# EAGLE design EQBasePCB_V_1_0 (EAGLE 9.5.2)
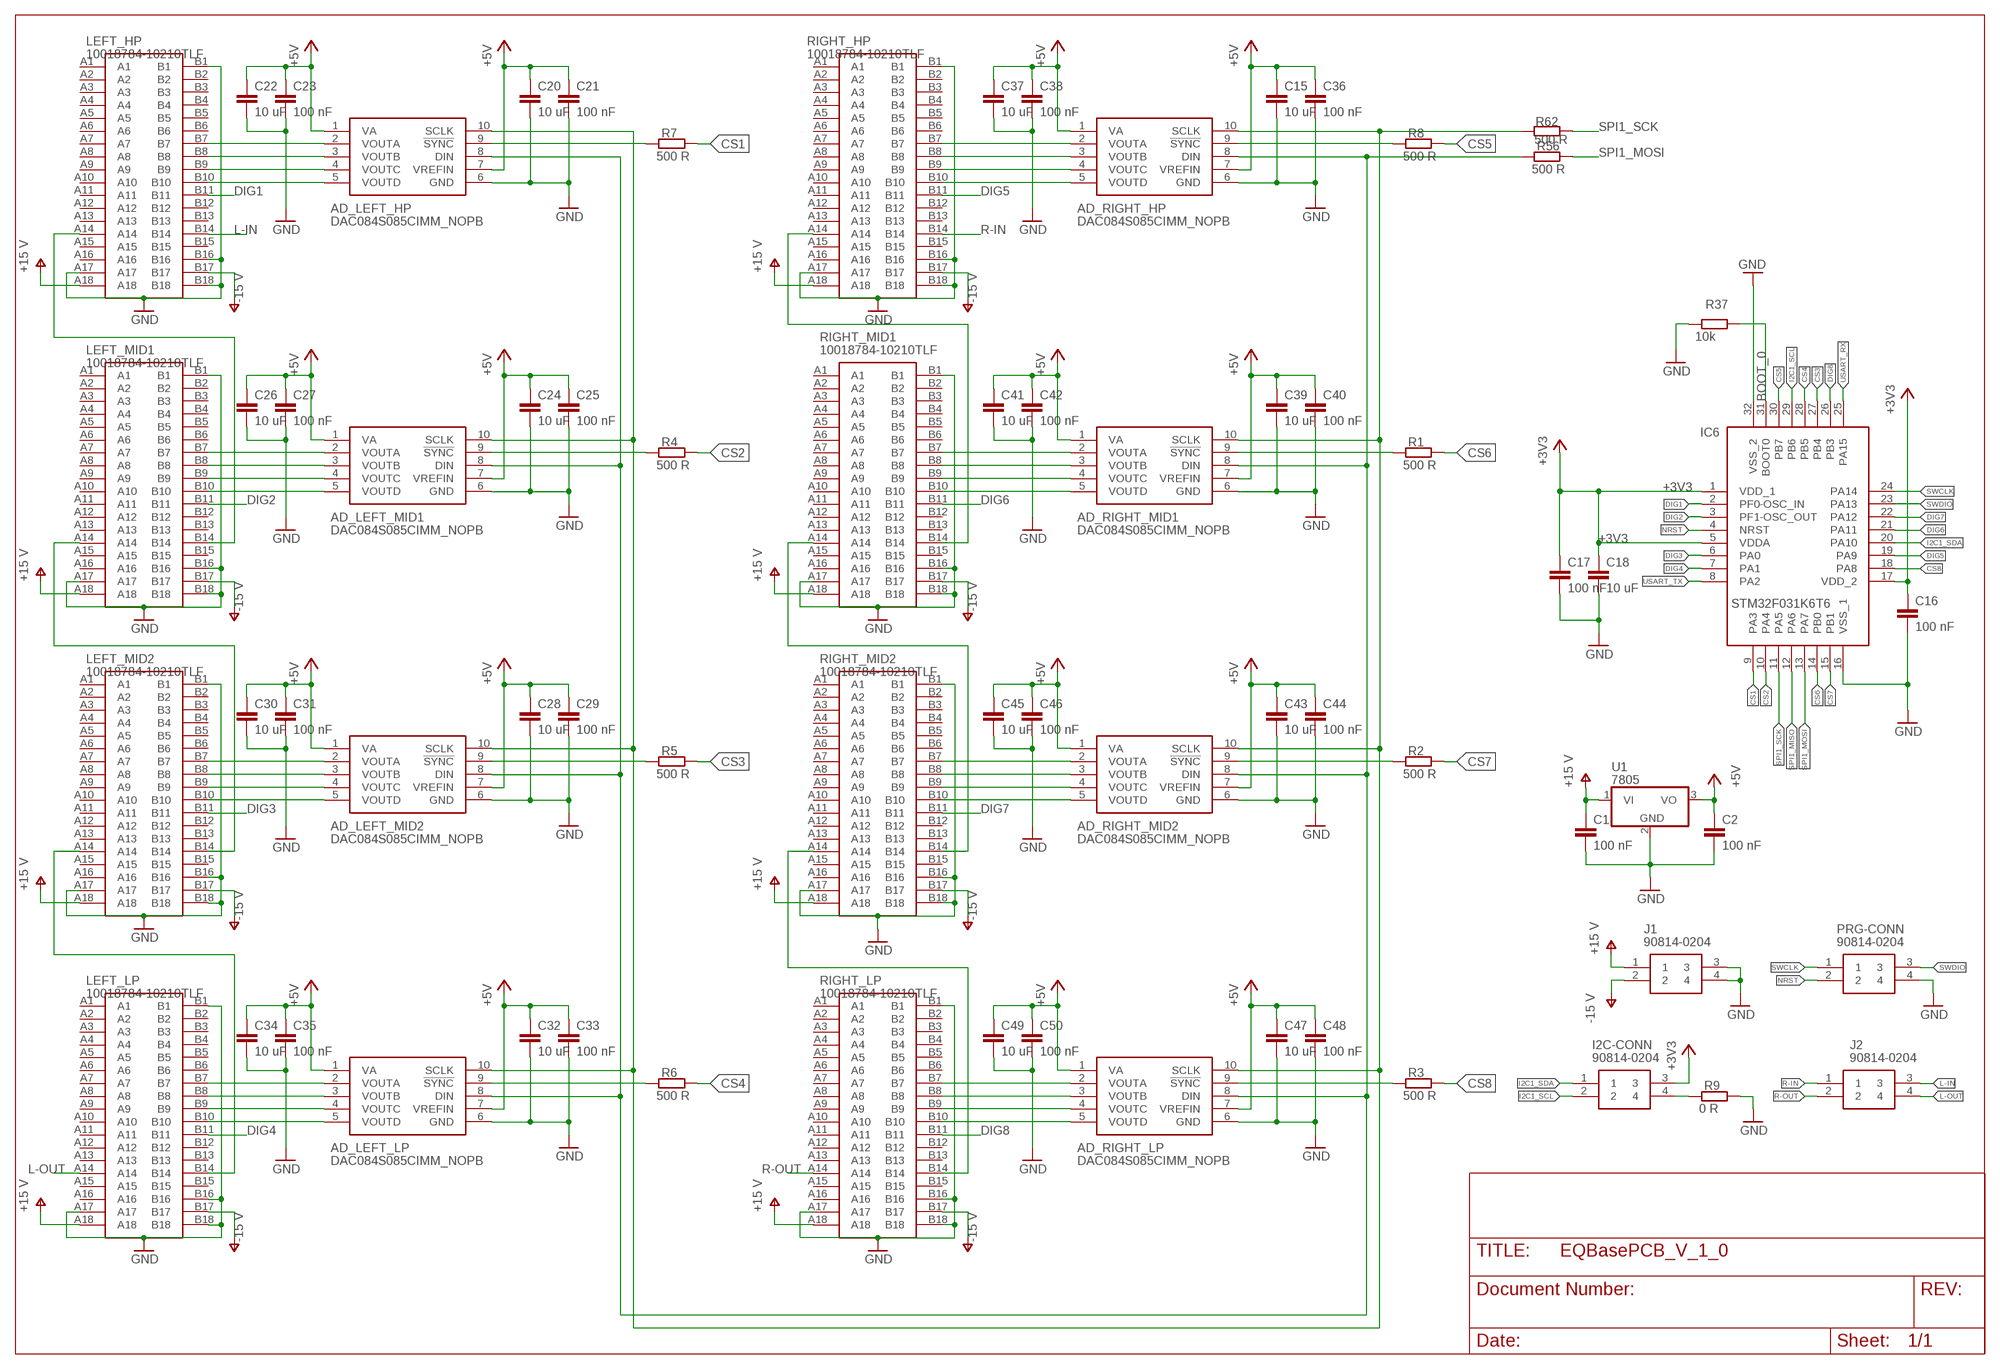
[diagram p0: schematic, sheet 1]

## Parts
AD_LEFT_HP  DAC084S085CIMM_NOPB  [SOP50P490X110-10N]
AD_LEFT_LP  DAC084S085CIMM_NOPB  [SOP50P490X110-10N]
AD_LEFT_MID1  DAC084S085CIMM_NOPB  [SOP50P490X110-10N]
AD_LEFT_MID2  DAC084S085CIMM_NOPB  [SOP50P490X110-10N]
AD_RIGHT_HP  DAC084S085CIMM_NOPB  [SOP50P490X110-10N]
AD_RIGHT_LP  DAC084S085CIMM_NOPB  [SOP50P490X110-10N]
AD_RIGHT_MID1  DAC084S085CIMM_NOPB  [SOP50P490X110-10N]
AD_RIGHT_MID2  DAC084S085CIMM_NOPB  [SOP50P490X110-10N]
C1  100 nF  CAPACITOR_0603  [C0603]
C2  100 nF  CAPACITOR_0603  [C0603]
C15  10 uF  CAPACITOR_1206  [C1206]
C16  100 nF  CAPACITOR_0603  [C0603]
C17  100 nF  CAPACITOR_0603  [C0603]
C18  10 uF  CAPACITOR_1206  [C1206]
C20  10 uF  CAPACITOR_1206  [C1206]
C21  100 nF  CAPACITOR_0603  [C0603]
C22  10 uF  CAPACITOR_1206  [C1206]
C23  100 nF  CAPACITOR_0603  [C0603]
C24  10 uF  CAPACITOR_1206  [C1206]
C25  100 nF  CAPACITOR_0603  [C0603]
C26  10 uF  CAPACITOR_1206  [C1206]
C27  100 nF  CAPACITOR_0603  [C0603]
C28  10 uF  CAPACITOR_1206  [C1206]
C29  100 nF  CAPACITOR_0603  [C0603]
C30  10 uF  CAPACITOR_1206  [C1206]
C31  100 nF  CAPACITOR_0603  [C0603]
C32  10 uF  CAPACITOR_1206  [C1206]
C33  100 nF  CAPACITOR_0603  [C0603]
C34  10 uF  CAPACITOR_1206  [C1206]
C35  100 nF  CAPACITOR_0603  [C0603]
C36  100 nF  CAPACITOR_0603  [C0603]
C37  10 uF  CAPACITOR_1206  [C1206]
C38  100 nF  CAPACITOR_0603  [C0603]
C39  10 uF  CAPACITOR_1206  [C1206]
C40  100 nF  CAPACITOR_0603  [C0603]
C41  10 uF  CAPACITOR_1206  [C1206]
C42  100 nF  CAPACITOR_0603  [C0603]
C43  10 uF  CAPACITOR_1206  [C1206]
C44  100 nF  CAPACITOR_0603  [C0603]
C45  10 uF  CAPACITOR_1206  [C1206]
C46  100 nF  CAPACITOR_0603  [C0603]
C47  10 uF  CAPACITOR_1206  [C1206]
C48  100 nF  CAPACITOR_0603  [C0603]
C49  10 uF  CAPACITOR_1206  [C1206]
C50  100 nF  CAPACITOR_0603  [C0603]
I2C-CONN  90814-0204  [MOLEX_90814-0204]
IC6  STM32F031K6T6  [QFP80P900X900X160-32N]
J1  90814-0204  [MOLEX_90814-0204]
J2  90814-0204  [MOLEX_90814-0204]
LEFT_HP  10018784-10210TLF  [1001878410210TLF]
LEFT_LP  10018784-10210TLF  [1001878410210TLF]
LEFT_MID1  10018784-10210TLF  [1001878410210TLF]
LEFT_MID2  10018784-10210TLF  [1001878410210TLF]
PRG-CONN  90814-0204  [MOLEX_90814-0204]
R1  500 R  RESISTOR_0603  [R0603]
R2  500 R  RESISTOR_0603  [R0603]
R3  500 R  RESISTOR_0603  [R0603]
R4  500 R  RESISTOR_0603  [R0603]
R5  500 R  RESISTOR_0603  [R0603]
R6  500 R  RESISTOR_0603  [R0603]
R7  500 R  RESISTOR_0603  [R0603]
R8  500 R  RESISTOR_0603  [R0603]
R9  0 R  RESISTOR_0603  [R0603]
R37  10k  RESISTOR_0603  [R0603]
R56  500 R  RESISTOR_0603  [R0603]
R62  500 R  RESISTOR_0603  [R0603]
RIGHT_HP  10018784-10210TLF  [1001878410210TLF]
RIGHT_LP  10018784-10210TLF  [1001878410210TLF]
RIGHT_MID1  10018784-10210TLF  [1001878410210TLF]
RIGHT_MID2  10018784-10210TLF  [1001878410210TLF]
U1  7805  78_SMD  [TO252]

## Nets
+3V3: C16.1 C17.1 C18.1 I2C-CONN.3 IC6.1(VDD_1) IC6.5(VDDA) IC6.17(VDD_2)
+5V: AD_LEFT_HP.1(VA) AD_LEFT_HP.7(VREFIN) AD_LEFT_LP.1(VA) AD_LEFT_LP.7(VREFIN) AD_LEFT_MID1.1(VA) AD_LEFT_MID1.7(VREFIN) AD_LEFT_MID2.1(VA) AD_LEFT_MID2.7(VREFIN) AD_RIGHT_HP.1(VA) AD_RIGHT_HP.7(VREFIN) AD_RIGHT_LP.1(VA) AD_RIGHT_LP.7(VREFIN) AD_RIGHT_MID1.1(VA) AD_RIGHT_MID1.7(VREFIN) AD_RIGHT_MID2.1(VA) AD_RIGHT_MID2.7(VREFIN) C2.1 C15.1 C20.1 C21.1 C22.1 C23.1 C24.1 C25.1 C26.1 C27.1 C28.1 C29.1 C30.1 C31.1 C32.1 C33.1 C34.1 C35.1 C36.1 C37.1 C38.1 C39.1 C40.1 C41.1 C42.1 C43.1 C44.1 C45.1 C46.1 C47.1 C48.1 C49.1 C50.1 U1.3(VO)
BOOT_0: IC6.31(BOOT0) R37.2
CS1: IC6.9(PA3) R7.2
CS2: IC6.10(PA4) R4.2
CS3: IC6.27(PB4) R5.2
CS4: IC6.28(PB5) R6.2
CS5: IC6.30(PB7) R8.2
CS6: IC6.14(PB0) R1.2
CS7: IC6.15(PB1) R2.2
CS8: IC6.18(PA8) R3.2
DIG1: IC6.2(PF0-OSC_IN) LEFT_HP.B11
DIG2: IC6.3(PF1-OSC_OUT) LEFT_MID1.B11
DIG3: IC6.6(PA0) LEFT_MID2.B11
DIG4: IC6.7(PA1) LEFT_LP.B11
DIG5: IC6.19(PA9) RIGHT_HP.B11
DIG6: IC6.21(PA11) RIGHT_MID1.B11
DIG7: IC6.22(PA12) RIGHT_MID2.B11
DIG8: IC6.26(PB3) RIGHT_LP.B11
GND: AD_LEFT_HP.6(GND) AD_LEFT_LP.6(GND) AD_LEFT_MID1.6(GND) AD_LEFT_MID2.6(GND) AD_RIGHT_HP.6(GND) AD_RIGHT_LP.6(GND) AD_RIGHT_MID1.6(GND) AD_RIGHT_MID2.6(GND) C1.2 C2.2 C15.2 C16.2 C17.2 C18.2 C20.2 C21.2 C22.2 C23.2 C24.2 C25.2 C26.2 C27.2 C28.2 C29.2 C30.2 C31.2 C32.2 C33.2 C34.2 C35.2 C36.2 C37.2 C38.2 C39.2 C40.2 C41.2 C42.2 C43.2 C44.2 C45.2 C46.2 C47.2 C48.2 C49.2 C50.2 IC6.16(VSS_1) IC6.32(VSS_2) J1.3 J1.4 LEFT_HP.A17 LEFT_HP.B1 LEFT_HP.B16 LEFT_HP.B18 LEFT_LP.A17 LEFT_LP.B1 LEFT_LP.B16 LEFT_LP.B18 LEFT_MID1.A17 LEFT_MID1.B1 LEFT_MID1.B16 LEFT_MID1.B18 LEFT_MID2.A17 LEFT_MID2.B1 LEFT_MID2.B16 LEFT_MID2.B18 PRG-CONN.4 R9.2 R37.1 RIGHT_HP.A17 RIGHT_HP.B1 RIGHT_HP.B16 RIGHT_HP.B18 RIGHT_LP.A17 RIGHT_LP.B1 RIGHT_LP.B16 RIGHT_LP.B18 RIGHT_MID1.A17 RIGHT_MID1.B1 RIGHT_MID1.B16 RIGHT_MID1.B18 RIGHT_MID2.A17 RIGHT_MID2.B1 RIGHT_MID2.B16 RIGHT_MID2.B18 U1.2(GND)
I2C1_SCL: I2C-CONN.2 IC6.29(PB6)
I2C1_SDA: I2C-CONN.1 IC6.20(PA10)
L-IN: J2.3 LEFT_HP.B14
L-OUT: J2.4 LEFT_LP.A14
N$1: AD_RIGHT_MID1.9(!SYNC) R1.1
N$2: AD_LEFT_MID1.5(VOUTD) LEFT_MID1.B10
N$3: I2C-CONN.4 R9.1
N$4: LEFT_HP.A14 LEFT_MID1.B14
N$5: LEFT_MID1.A14 LEFT_MID2.B14
N$6: LEFT_LP.B14 LEFT_MID2.A14
N$7: RIGHT_HP.A14 RIGHT_MID1.B14
N$8: RIGHT_MID1.A14 RIGHT_MID2.B14
N$9: RIGHT_LP.B14 RIGHT_MID2.A14
N$31: AD_LEFT_HP.8(DIN) AD_LEFT_LP.8(DIN) AD_LEFT_MID1.8(DIN) AD_LEFT_MID2.8(DIN) AD_RIGHT_HP.8(DIN) AD_RIGHT_LP.8(DIN) AD_RIGHT_MID1.8(DIN) AD_RIGHT_MID2.8(DIN) R56.1
N$32: AD_LEFT_HP.9(!SYNC) R7.1
N$33: AD_LEFT_HP.10(SCLK) AD_LEFT_LP.10(SCLK) AD_LEFT_MID1.10(SCLK) AD_LEFT_MID2.10(SCLK) AD_RIGHT_HP.10(SCLK) AD_RIGHT_LP.10(SCLK) AD_RIGHT_MID1.10(SCLK) AD_RIGHT_MID2.10(SCLK) R62.1
N$34: AD_LEFT_HP.2(VOUTA) LEFT_HP.B7
N$35: AD_LEFT_HP.3(VOUTB) LEFT_HP.B8
N$36: AD_LEFT_HP.4(VOUTC) LEFT_HP.B9
N$37: AD_LEFT_HP.5(VOUTD) LEFT_HP.B10
N$39: AD_LEFT_MID1.9(!SYNC) R4.1
N$41: AD_LEFT_MID1.2(VOUTA) LEFT_MID1.B7
N$42: AD_LEFT_MID1.3(VOUTB) LEFT_MID1.B8
N$43: AD_LEFT_MID1.4(VOUTC) LEFT_MID1.B9
N$46: AD_LEFT_MID2.9(!SYNC) R5.1
N$48: AD_LEFT_MID2.2(VOUTA) LEFT_MID2.B7
N$49: AD_LEFT_MID2.3(VOUTB) LEFT_MID2.B8
N$50: AD_LEFT_MID2.4(VOUTC) LEFT_MID2.B9
N$51: AD_LEFT_MID2.5(VOUTD) LEFT_MID2.B10
N$53: AD_LEFT_LP.9(!SYNC) R6.1
N$55: AD_LEFT_LP.2(VOUTA) LEFT_LP.B7
N$59: AD_LEFT_LP.3(VOUTB) LEFT_LP.B8
N$60: AD_LEFT_LP.4(VOUTC) LEFT_LP.B9
N$61: AD_LEFT_LP.5(VOUTD) LEFT_LP.B10
N$63: AD_RIGHT_HP.9(!SYNC) R8.1
N$65: AD_RIGHT_HP.2(VOUTA) RIGHT_HP.B7
N$68: AD_RIGHT_HP.3(VOUTB) RIGHT_HP.B8
N$69: AD_RIGHT_HP.4(VOUTC) RIGHT_HP.B9
N$70: AD_RIGHT_HP.5(VOUTD) RIGHT_HP.B10
N$75: AD_RIGHT_MID1.2(VOUTA) RIGHT_MID1.B7
N$76: AD_RIGHT_MID1.3(VOUTB) RIGHT_MID1.B8
N$77: AD_RIGHT_MID1.4(VOUTC) RIGHT_MID1.B9
N$78: AD_RIGHT_MID1.5(VOUTD) RIGHT_MID1.B10
N$80: AD_RIGHT_MID2.9(!SYNC) R2.1
N$82: AD_RIGHT_MID2.2(VOUTA) RIGHT_MID2.B7
N$83: AD_RIGHT_MID2.3(VOUTB) RIGHT_MID2.B8
N$84: AD_RIGHT_MID2.4(VOUTC) RIGHT_MID2.B9
N$85: AD_RIGHT_MID2.5(VOUTD) RIGHT_MID2.B10
N$87: AD_RIGHT_LP.9(!SYNC) R3.1
N$89: AD_RIGHT_LP.2(VOUTA) RIGHT_LP.B7
N$90: AD_RIGHT_LP.3(VOUTB) RIGHT_LP.B8
N$91: AD_RIGHT_LP.4(VOUTC) RIGHT_LP.B9
N$92: AD_RIGHT_LP.5(VOUTD) RIGHT_LP.B10
NRST: IC6.4(NRST) PRG-CONN.2
R-IN: J2.1 RIGHT_HP.B14
R-OUT: J2.2 RIGHT_LP.A14
SPI1_MISO: IC6.12(PA6)
SPI1_MOSI: IC6.13(PA7) R56.2
SPI1_SCK: IC6.11(PA5) R62.2
SWCLK: IC6.24(PA14) PRG-CONN.1
SWDIO: IC6.23(PA13) PRG-CONN.3
USART_RX: IC6.25(PA15)
USART_TX: IC6.8(PA2)
V+: C1.1 J1.1 LEFT_HP.A18 LEFT_LP.A18 LEFT_MID1.A18 LEFT_MID2.A18 RIGHT_HP.A18 RIGHT_LP.A18 RIGHT_MID1.A18 RIGHT_MID2.A18 U1.1(VI) ; supply symbol labelled +15 V
V-: J1.2 LEFT_HP.B17 LEFT_LP.B17 LEFT_MID1.B17 LEFT_MID2.B17 RIGHT_HP.B17 RIGHT_LP.B17 RIGHT_MID1.B17 RIGHT_MID2.B17 ; supply symbol labelled -15 V
Unconnected: LEFT_HP.A1 LEFT_HP.A2 LEFT_HP.A3 LEFT_HP.A4 LEFT_HP.A5 LEFT_HP.A6 LEFT_HP.A7 LEFT_HP.A8 LEFT_HP.A9 LEFT_HP.A10 LEFT_HP.A11 LEFT_HP.A12 LEFT_HP.A13 LEFT_HP.A15 LEFT_HP.A16 LEFT_HP.B2 LEFT_HP.B3 LEFT_HP.B4 LEFT_HP.B5 LEFT_HP.B6 LEFT_HP.B12 LEFT_HP.B13 LEFT_HP.B15 LEFT_LP.A1 LEFT_LP.A2 LEFT_LP.A3 LEFT_LP.A4 LEFT_LP.A5 LEFT_LP.A6 LEFT_LP.A7 LEFT_LP.A8 LEFT_LP.A9 LEFT_LP.A10 LEFT_LP.A11 LEFT_LP.A12 LEFT_LP.A13 LEFT_LP.A15 LEFT_LP.A16 LEFT_LP.B2 LEFT_LP.B3 LEFT_LP.B4 LEFT_LP.B5 LEFT_LP.B6 LEFT_LP.B12 LEFT_LP.B13 LEFT_LP.B15 LEFT_MID1.A1 LEFT_MID1.A2 LEFT_MID1.A3 LEFT_MID1.A4 LEFT_MID1.A5 LEFT_MID1.A6 LEFT_MID1.A7 LEFT_MID1.A8 LEFT_MID1.A9 LEFT_MID1.A10 LEFT_MID1.A11 LEFT_MID1.A12 LEFT_MID1.A13 LEFT_MID1.A15 LEFT_MID1.A16 LEFT_MID1.B2 LEFT_MID1.B3 LEFT_MID1.B4 LEFT_MID1.B5 LEFT_MID1.B6 LEFT_MID1.B12 LEFT_MID1.B13 LEFT_MID1.B15 LEFT_MID2.A1 LEFT_MID2.A2 LEFT_MID2.A3 LEFT_MID2.A4 LEFT_MID2.A5 LEFT_MID2.A6 LEFT_MID2.A7 LEFT_MID2.A8 LEFT_MID2.A9 LEFT_MID2.A10 LEFT_MID2.A11 LEFT_MID2.A12 LEFT_MID2.A13 LEFT_MID2.A15 LEFT_MID2.A16 LEFT_MID2.B2 LEFT_MID2.B3 LEFT_MID2.B4 LEFT_MID2.B5 LEFT_MID2.B6 LEFT_MID2.B12 LEFT_MID2.B13 LEFT_MID2.B15 RIGHT_HP.A1 RIGHT_HP.A2 RIGHT_HP.A3 RIGHT_HP.A4 RIGHT_HP.A5 RIGHT_HP.A6 RIGHT_HP.A7 RIGHT_HP.A8 RIGHT_HP.A9 RIGHT_HP.A10 RIGHT_HP.A11 RIGHT_HP.A12 RIGHT_HP.A13 RIGHT_HP.A15 RIGHT_HP.A16 RIGHT_HP.B2 RIGHT_HP.B3 RIGHT_HP.B4 RIGHT_HP.B5 RIGHT_HP.B6 RIGHT_HP.B12 RIGHT_HP.B13 RIGHT_HP.B15 RIGHT_LP.A1 RIGHT_LP.A2 RIGHT_LP.A3 RIGHT_LP.A4 RIGHT_LP.A5 RIGHT_LP.A6 RIGHT_LP.A7 RIGHT_LP.A8 RIGHT_LP.A9 RIGHT_LP.A10 RIGHT_LP.A11 RIGHT_LP.A12 RIGHT_LP.A13 RIGHT_LP.A15 RIGHT_LP.A16 RIGHT_LP.B2 RIGHT_LP.B3 RIGHT_LP.B4 RIGHT_LP.B5 RIGHT_LP.B6 RIGHT_LP.B12 RIGHT_LP.B13 RIGHT_LP.B15 RIGHT_MID1.A1 RIGHT_MID1.A2 RIGHT_MID1.A3 RIGHT_MID1.A4 RIGHT_MID1.A5 RIGHT_MID1.A6 RIGHT_MID1.A7 RIGHT_MID1.A8 RIGHT_MID1.A9 RIGHT_MID1.A10 RIGHT_MID1.A11 RIGHT_MID1.A12 RIGHT_MID1.A13 RIGHT_MID1.A15 RIGHT_MID1.A16 RIGHT_MID1.B2 RIGHT_MID1.B3 RIGHT_MID1.B4 RIGHT_MID1.B5 RIGHT_MID1.B6 RIGHT_MID1.B12 RIGHT_MID1.B13 RIGHT_MID1.B15 RIGHT_MID2.A1 RIGHT_MID2.A2 RIGHT_MID2.A3 RIGHT_MID2.A4 RIGHT_MID2.A5 RIGHT_MID2.A6 RIGHT_MID2.A7 RIGHT_MID2.A8 RIGHT_MID2.A9 RIGHT_MID2.A10 RIGHT_MID2.A11 RIGHT_MID2.A12 RIGHT_MID2.A13 RIGHT_MID2.A15 RIGHT_MID2.A16 RIGHT_MID2.B2 RIGHT_MID2.B3 RIGHT_MID2.B4 RIGHT_MID2.B5 RIGHT_MID2.B6 RIGHT_MID2.B12 RIGHT_MID2.B13 RIGHT_MID2.B15

## Library data of the parts
AD_LEFT_HP AD_LEFT_LP AD_LEFT_MID1 AD_LEFT_MID2 AD_RIGHT_HP AD_RIGHT_LP AD_RIGHT_MID1 AD_RIGHT_MID2 = SPI:DAC084S085CIMM_NOPB: 8-Bit Micro Power QUAD Digital-to-Analog Converter with Rail-to-Rail Output Source: Datasheet <http://www.ti.com/general/docs/suppproductinfo.tsp?distId=10&gotoUrl=http://www.ti.com/lit/gpn/dac084s085>; MOUSER_PART_NUMBER: 926-DAC084S085CIMMNO
C1 C2 C15-C18 C20-C50 = passive components:CAPACITOR: ceramic capacitor
I2C-CONN J1 J2 PRG-CONN = electro_mechanical:90814-0204: CONN HEADER 4POS 1.27MM SMD TIN Source: Datasheet <https://componentsearchengine.com/Datasheets/1/90814-0204.pdf>; DESCRIPTION: CONN HEADER 4POS 1.27MM SMD TIN; HEIGHT: mm; MANUFACTURER_NAME: Molex; MANUFACTURER_PART_NUMBER: 90814-0204; MOUSER_PART_NUMBER: 538-90814-0204; MOUSER_PRICE-STOCK: https://www.mouser.com/Search/Refine.aspx?Keyword=538-90814-0204
IC6 = C_Sager_Bibliothek:STM32F031K6T6: ARM Microcontrollers - MCU 16/32-BITS MICROS Source: Datasheet <https://componentsearchengine.com/Datasheets/1/STM32F031K6T6.pdf>; DESCRIPTION: ARM Microcontrollers - MCU 16/32-BITS MICROS; HEIGHT: 1.6mm; MANUFACTURER_NAME: STMicroelectronics; MANUFACTURER_PART_NUMBER: STM32F031K6T6; MOUSER_PART_NUMBER: 511-STM32F031K6T6; MOUSER_PRICE-STOCK: https://www.mouser.com/Search/Refine.aspx?Keyword=511-STM32F031K6T6
LEFT_HP LEFT_LP LEFT_MID1 LEFT_MID2 RIGHT_HP RIGHT_LP RIGHT_MID1 RIGHT_MID2 = electro_mechanical:10018784-10210TLF: PCI Express / PCI Connectors 36P CARD EDGE ASSM VERTICAL Source: Datasheet <https://componentsearchengine.com/Datasheets/1/10018784-10210TLF.pdf>; DESCRIPTION: PCI Express / PCI Connectors 36P CARD EDGE ASSM VERTICAL; HEIGHT: 11.25mm; MANUFACTURER_NAME: Amphenol; MANUFACTURER_PART_NUMBER: 10018784-10210TLF; MOUSER_PART_NUMBER: 649-1001878410210TLF; MOUSER_PRICE-STOCK: https://www.mouser.com/Search/Refine.aspx?Keyword=649-1001878410210TLF
R1-R9 R37 R56 R62 = passive components:RESISTOR: +/- 5 % resistor
U1 = passive components:78**

## Board
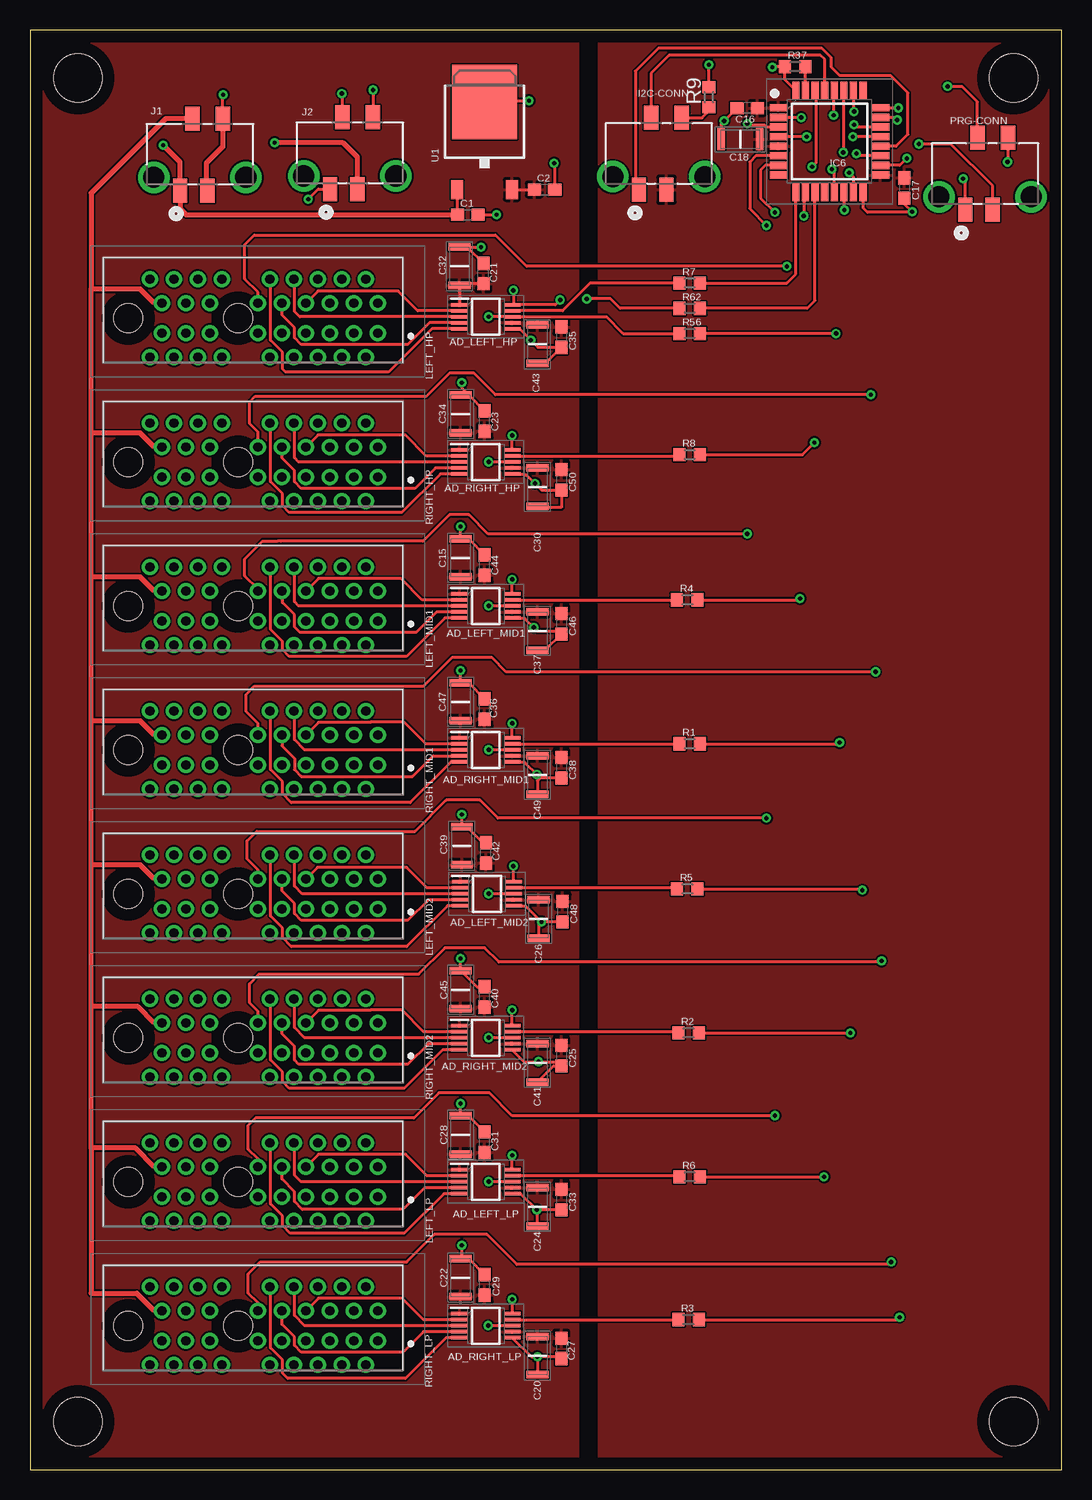
[diagram p1: board, top side]
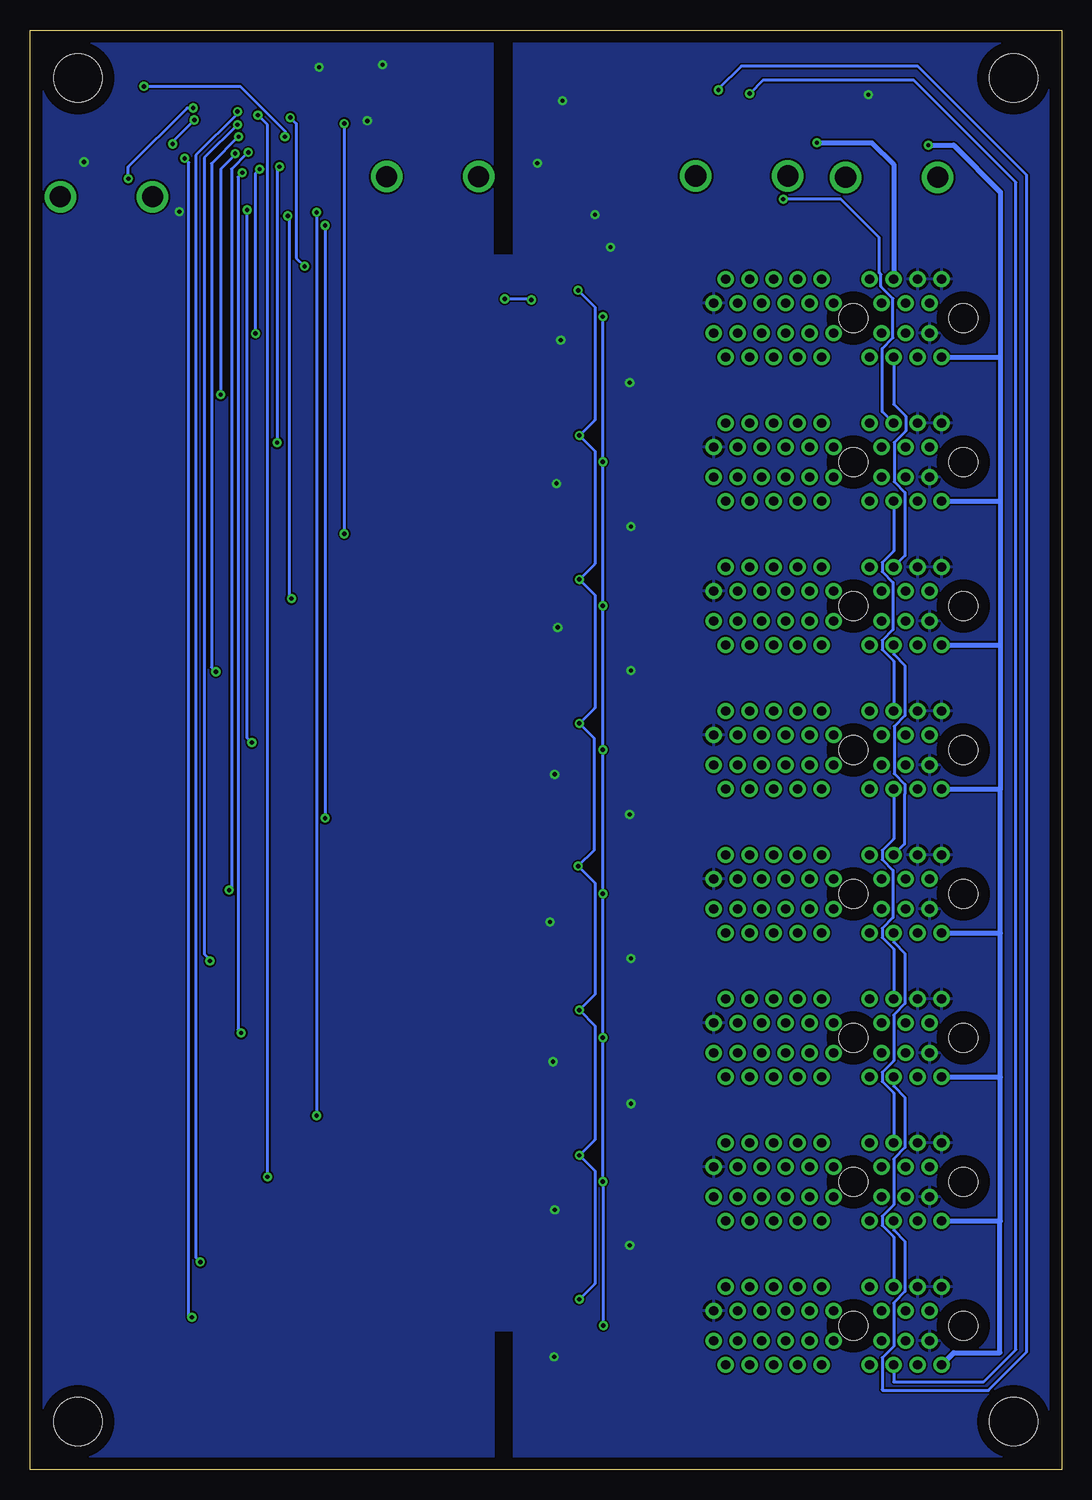
[diagram p2: board, bottom side, seen from below]

Size 86 x 120 mm. Coordinates in mm from the lower left corner, seen from the top.
Outline: 0,0 86,0 86,120 0,120 0,0
Copper layers (1*16): Top 0.035mm / dielectric 1.5mm / Bottom 0.035mm
Design rules "default": minimum track width 6mil, minimum drill 0.35mm, track to track 6mil, track to pad 6mil, pad to pad 6mil, via to via 6mil, smd to smd 6mil, copper to edge 40mil, drill to drill 6mil, minimum pad ring 10mil, minimum via ring 8mil, stop-mask expansion 4mil, vias tented up to drill 0mil, thermal gap 10mil
Holes 4 mm at 4,4 4,116 82,116 82,4

### Footprints (pad centres in the part's own frame; a part is rotated, then mirrored left to right if it is on the bottom)
SOP50P490X110-10N = smd 1.4 x 0.3: 1 -2.2,1; 2 -2.2,0.5; 3 -2.2,0; 4 -2.2,-0.5; 5 -2.2,-1; 6 2.2,-1; 7 2.2,-0.5; 8 2.2,0; 9 2.2,0.5; 10 2.2,1
C0603 = smd 1.1 x 1: 1 -0.85,0; 2 0.85,0
C1206 = smd 0.62 x 1.82: 1 -1.6,0; 2 1.6,0
MOLEX_90814-0204 = smd 1.194 x 2.007: 1 0.254,0; 2 1.27,5.994; 3 2.54,0; 4 3.81,5.994 | drill 1.753 pad 2.629: 5 -1.93,1.092; 6 5.74,1.092
QFP80P900X900X160-32N = smd 1.475 x 0.6: 1 -4.238,2.8; 2 -4.238,2; 3 -4.238,1.2; 4 -4.238,0.4; 5 -4.238,-0.4; 6 -4.238,-1.2; 7 -4.238,-2; 8 -4.238,-2.8; 17 4.238,-2.8; 18 4.238,-2; 19 4.238,-1.2; 20 4.238,-0.4; 21 4.238,0.4; 22 4.238,1.2; 23 4.238,2; 24 4.238,2.8 | smd 0.6 x 1.475: 9 -2.8,-4.238; 10 -2,-4.238; 11 -1.2,-4.238; 12 -0.4,-4.238; 13 0.4,-4.238; 14 1.2,-4.238; 15 2,-4.238; 16 2.8,-4.238; 25 2.8,4.238; 26 2,4.238; 27 1.2,4.238; 28 0.4,4.238; 29 -0.4,4.238; 30 -1.2,4.238; 31 -2,4.238; 32 -2.8,4.238
1001878410210TLF = drill 0.78 pad 1.337: A1 0,1.27; A2 1,3.27; A3 2,1.27; A4 3,3.27; A5 4,1.27; A6 5,3.27; A7 6,1.27; A8 7,3.27; A9 8,1.27; A10 9,3.27; A11 10,1.27; A12 13,3.27; A13 14,1.27; A14 15,3.27; A15 16,1.27; A16 17,3.27; A17 18,1.27; A18 19,3.27; B1 0,-1.23; B2 1,-3.23; B3 2,-1.23; B4 3,-3.23; B5 4,-1.23; B6 5,-3.23; B7 6,-1.23; B8 7,-3.23; B9 8,-1.23; B10 9,-3.23; B11 10,-1.23; B12 13,-3.23; B13 14,-1.23; B14 15,-3.23; B15 16,-1.23; B16 17,-3.23; B17 18,-1.23; B18 19,-3.23 | hole 2.4: 11.65,0.02; 20.8,0.02
R0603 = smd 1 x 1.1: 1 -0.85,0; 2 0.85,0
TO252 = smd 1 x 1.6: 1 -2.28,-4.8; 3 2.28,-4.8 | smd 5.4 x 6.2: 2 0,2.5

### Placement (x,y rotation side)
AD_LEFT_HP  38,96.1 0 top
AD_LEFT_LP  38,24 0 top
AD_LEFT_MID1  38,72 0 top
AD_LEFT_MID2  38.1,48 0 top
AD_RIGHT_HP  38,84 0 top
AD_RIGHT_LP  38,12 0 top
AD_RIGHT_MID1  38,60 0 top
AD_RIGHT_MID2  38,36 0 top
C1  36.5,104.6 0 top
C2  42.9,106.7 0 top
C15  35.9,76 90 top
C16  59.8,113.5 180 top
C17  72.9,106.82 270 top
C18  59.22,110.89 180 top
C20  42.3,9.5 270 top
C21  37.8,99.7 90 top
C22  35.9,16 90 top
C23  37.9,87.4 90 top
C24  42.3,21.9 270 top
C25  44.3,34.5 270 top
C26  42.4,45.9 270 top
C27  44.3,10.1 270 top
C28  35.9,27.9 90 top
C29  37.9,15.4 90 top
C30  42.3,81.9 270 top
C31  37.9,27.3 90 top
C32  35.8,100.3 90 top
C33  44.3,22.5 270 top
C34  35.9,88 90 top
C35  44.3,94.4 270 top
C36  37.9,63.4 90 top
C37  42.3,69.9 270 top
C38  44.3,58.5 270 top
C39  36,52 90 top
C40  37.9,39.4 90 top
C41  42.3,33.9 270 top
C42  38,51.4 90 top
C43  42.3,93.8 270 top
C44  37.9,75.4 90 top
C45  35.9,40 90 top
C46  44.3,70.5 270 top
C47  35.9,64 90 top
C48  44.4,46.5 270 top
C49  42.3,57.9 270 top
C50  44.3,82.5 270 top
I2C-CONN  50.52,106.69 0 top
IC6  66.65,110.71 0 top
J1  12.26,106.62 0 top
J2  24.76,106.74 0 top
LEFT_HP  29,96 180 top
LEFT_LP  29,24 180 top
LEFT_MID1  29,72 180 top
LEFT_MID2  29,48 180 top
PRG-CONN  77.72,105.01 0 top
R1  55,60.5 0 top
R2  54.9,36.4 0 top
R3  54.9,12.5 0 top
R4  54.8,72.5 0 top
R5  54.8,48.4 0 top
R6  55,24.4 0 top
R7  55,98.9 0 top
R8  55,84.6 0 top
R9  56.6,114.4 90 top
R37  63.79,116.95 0 top
R56  55,94.7 0 top
R62  55,96.8 0 top
RIGHT_HP  29,84 180 top
RIGHT_LP  29,12 180 top
RIGHT_MID1  29,60 180 top
RIGHT_MID2  29,36 180 top
U1  37.9,111.5 0 top

### Tracks (layer width: path | path; a pad name or v marks a point on that pad's centre or on a via)
+3V3
  pour Top: 47.4,119.9 47.4,0.1 86.3,0.1 86.3,119.9
+5V
  Top 0.254: U1.3 C2.1 | C21.1 35.95,98.85 C32.1 AD_LEFT_HP.1
  pour Top: 45.7,119.9 45.7,0.1 0.1,0.1 0.1,119.9
BOOT_0
  Top 0.254: IC6.31 R37.2
CS1
  Top 0.254: IC6.9 63.85,99.65 63.1,98.9 R7.2
CS2  (via drill 0.35)
  Top 0.254: R4.2 64.15,72.5 64.22,72.58 v64.2,72.6 | v64.51,104.5 64.51,106.33 IC6.10
  Bottom 0.254: v64.2,72.6 64.41,72.81 64.41,104.4 v64.51,104.5
CS3  (via drill 0.35)
  Top 0.254: IC6.27 67.8,114.9 v67.8,109.8 | R5.2 69.3,48.4 v69.4,48.3
  Bottom 0.254: v69.4,48.3 69.2,48.5 69.2,108.4 v67.8,109.8
CS4  (via drill 0.35)
  Top 0.254: R6.2 v66.2,24.4 | v67,112.9 67,114.9 IC6.28
  Bottom 0.254: v66.2,24.4 66.2,112.1 v67,112.9
CS5  (via drill 0.35)
  Top 0.254: R8.2 64.4,84.6 v65.4,85.6 | v65.2,108.6 65.5,108.9 65.5,114.9 IC6.30
  Bottom 0.254: v65.2,108.6 65.4,108.4 v65.4,85.6
CS6  (via drill 0.35)
  Top 0.254: R1.2 67.4,60.5 v67.5,60.6 | v67.9,105 67.9,106.42 IC6.14
  Bottom 0.254: v67.5,60.6 67.9,61 v67.9,105
CS7  (via drill 0.35)
  Top 0.254: R2.2 v68.4,36.4 | v68.3,108.1 68.65,107.75 IC6.15
  Bottom 0.254: v68.4,36.4 68.66,36.66 68.66,107.74 v68.3,108.1
CS8  (via drill 0.35)
  Top 0.254: v73.1,109.3 72.51,108.71 IC6.18 | R3.2 72.3,12.5 v72.5,12.7
  Bottom 0.254: v72.5,12.7 72.76,12.7 72.76,108.96 v73.1,109.3
DIG1  (via drill 0.35)
  Top 0.254: IC6.2 v64.29,112.71 v64.3,112.7 | v63.09,100.3 41.4,100.3 38.8,102.9 18.7,102.9 17.9,102.1 17.9,99.23 19,98.13 LEFT_HP.B11
  Bottom 0.254: v64.3,112.7 63.79,112.19 63.79,101 v63.09,100.3
DIG2  (via drill 0.35)
  Top 0.254: IC6.3 61.41,111.91 61.25,112.08 59.92,112.08 v59.8,112.2 | v59.8,78 38.2,78 36.6,79.6 34.98,79.6 32.76,77.38 20.9,77.38 20.65,77.38 19.38,77.38 17.9,75.9 17.9,74.5 19,73.4 LEFT_MID1.B11
  Bottom 0.254: v59.8,112.2 v59.8,78
DIG3  (via drill 0.35)
  Top 0.254: IC6.6 60.51,109.51 60,109 60,105.11 v61.41,103.71 | v61.4,54.3 39,54.3 37.5,55.8 34.7,55.8 32.1,53.2 18.9,53.2 18.1,52.4 18.1,50.9 19,50 LEFT_MID2.B11
  Bottom 0.254: v61.41,103.71 v61.41,54.31 v61.4,54.3
DIG4  (via drill 0.35)
  Top 0.254: IC6.7 61.31,108.71 60.9,108.3 60.9,106 v62.1,104.8 | v62.1,29.5 40.2,29.5 38.3,31.4 34.1,31.4 32,29.3 18.8,29.3 18.2,28.7 18.2,26.7 19,25.9 LEFT_LP.B11
  Bottom 0.254: v62.1,104.8 v62.1,29.5
DIG5  (via drill 0.35)
  Top 0.254: IC6.19 69.09,109.51 v68.9,109.7 | v70.1,89.6 38.8,89.6 37,91.4 34.98,91.4 33.06,89.48 18.78,89.48 18.3,89 18.3,87.2 19,86.5 RIGHT_HP.B11
  Bottom 0.254: v68.9,109.7 68.9,109.6 70.1,108.4 v70.1,89.6
DIG6  (via drill 0.35)
  Top 0.254: IC6.21 70.88,111.1 v68.6,111.1 | v70.5,66.5 39.7,66.5 38.5,67.7 35.2,67.7 32.8,65.3 18.7,65.3 18,64.6 18,63.2 19,62.2 RIGHT_MID1.B11
  Bottom 0.254: v68.6,111.1 68.63,111.1 70.86,108.87 70.86,66.86 v70.5,66.5
DIG7  (via drill 0.35)
  Top 0.254: IC6.22 68.89,111.91 v68.7,112.1 | v71,42.4 70.9,42.3 39.1,42.3 37.9,43.5 34.6,43.5 32.4,41.3 19.1,41.3 18.3,40.5 18.3,38.9 19,38.2 RIGHT_MID2.B11
  Bottom 0.254: v68.7,112.1 71.46,109.34 71.46,42.96 71,42.5 v71,42.4
DIG8  (via drill 0.35)
  Top 0.254: IC6.26 68.65,113.25 v68.7,113.2 | v71.8,17.3 71.6,17.1 40.6,17.1 38.1,19.6 33.7,19.6 31.4,17.3 19.2,17.3 18.2,16.3 18.2,14.7 19,13.9 RIGHT_LP.B11
  Bottom 0.254: v68.7,113.2 68.7,113.03 72.17,109.56 72.17,17.67 v71.8,17.3
GND  (via drill 0.35)
  Top 0.254: IC6.32 62.94,115.86 R37.1 61.95,116.95 v61.9,116.9 | C16.2 v57.88,112.42 57.62,112.17 C18.2 | IC6.16 69.45,105.17 69.82,104.8 73.5,104.8 v73.55,104.85 72.9,105.5 C17.2 | R9.2 v56.6,117.1 | PRG-CONN.4 81.5,111 v81.5,109 | C2.2 43.75,108.85 v43.7,108.9 | U1.2 38,114.1 v41.6,114.1 | C1.2 v38.9,104.6 | J1.4 16.07,114.57 v16.1,114.6 | 14.7,106.72 J1.3 | C21.2 36.45,101.9 C32.2 v37.6,101.9 | AD_LEFT_HP.6 40.8,95.1 v41.75,94.15 42.35,93.55 C35.2 42.95,92.2 C43.2 | C34.2 36.55,89.6 | 36.55,89.6 C23.2 | AD_RIGHT_HP.6 41.19,83 41.27,82.91 41.39,82.91 v42.1,82.2 42.65,81.65 C50.2 44.3,80.2 42.2,80.2 C30.2 | C44.2 36.55,77.6 C15.2 v35.9,78.6 | AD_LEFT_MID1.6 41.19,71 41.27,70.91 41.29,70.91 v42,70.2 42.3,69.9 44.05,69.9 C46.2 42.95,68.3 C37.2 | C36.2 36.55,65.6 C47.2 v35.9,66.6 | C42.2 37.75,52.25 36.4,53.6 C39.2 v36,54.6 | C31.2 36.55,29.5 C28.2 v35.9,30.5 | 36.55,89.6 36,90.15 v36,90.6 | v35.9,42.6 C45.2 37.25,40.25 C40.2 | C41.2 43.65,33.65 44.2,33.65 | 44.2,33.65 C25.2 | AD_RIGHT_MID1.6 41.19,59 41.27,58.91 41.29,58.91 v42.25,57.95 42.55,57.65 | C38.2 42.55,57.65 | 42.55,57.65 42.3,57.4 C49.2 | AD_LEFT_MID2.6 41.28,47 41.37,46.91 41.39,46.91 v42.65,45.65 | C48.2 v42.65,45.65 | v42.65,45.65 42.4,45.4 C26.2 | AD_RIGHT_MID2.6 41.2,34 v42.4,34 43.85,34 44.2,33.65 | AD_LEFT_LP.6 40.9,23 v42.25,21.65 | C33.2 v42.25,21.65 | v42.25,21.65 42.25,20.35 C24.2 | AD_RIGHT_LP.6 41.8,9.4 v42.3,9.4 42.4,9.4 | C27.2 44.15,9.4 42.4,9.4 | 42.4,9.4 42.3,9.3 C20.2 | C29.2 36.55,17.6 C22.2 36,17.7 v36,18.7
  Top 0.406: J1.4 16.07,110.27 14.7,108.9 14.7,106.72
  pour Bottom: 45.7,119.9 45.7,101.2 47.4,101.2 47.4,119.9 86.3,119.9 86.29,0.1 47.3,0.1 47.3,11.6 45.7,11.6 45.7,0.1 0.1,0.1 0.1,119.9
I2C1_SCL
  Top 0.254: I2C-CONN.2 51.79,116.38 53.29,117.88 65.91,117.88 66.25,117.55 IC6.29
I2C1_SDA
  Top 0.254: IC6.20 72.2,110.31 73.2,111.31 73.2,114.77 71.77,116.2 67.5,116.2 66.8,116.9 66.8,117.7 66,118.5 52.4,118.5 50.47,116.57 50.47,106.99 I2C-CONN.1
L-IN  (via drill 0.35)
  Top 0.406: J2.3 27.3,109.4 26.1,110.6 v20.4,110.6
  Bottom 0.406: v20.4,110.6 15.8,110.6 14,108.8 LEFT_HP.B14
L-OUT  (via drill 0.35)
  Top 0.254: v28.6,115 28.6,112.76 J2.4
  Bottom 0.254: LEFT_LP.A14 14,19.96 13.05,19.02 13.05,14.84 14,13.89 14,10.27 14.95,9.32 14.95,6.65 14.9,6.6 6.1,6.6 2.9,9.8 2.9,107.9 12,117 26.7,117 28.6,115.1 v28.6,115
N$1
  Top 0.254: AD_RIGHT_MID1.9 R1.1
N$2
  Top 0.254: AD_LEFT_MID1.5 34.6,71 31.38,67.78 21.61,67.78 21.05,68.34 21.05,69.04 20.05,70.04 20.05,75.18 LEFT_MID1.B10
N$3
  Top 0.254: R9.1 56.6,113.25 56.03,112.68 I2C-CONN.4
N$4
  Bottom 0.254: LEFT_HP.A14 14,88.8 13,87.8 13,86.57 13.95,85.62 13.95,82.34 13.05,81.44 13.05,76.18 LEFT_MID1.B14
N$5
  Bottom 0.254: LEFT_MID1.A14 14,67.96 13.05,67.02 13.05,62.84 13.95,61.94 13.95,58.02 13.05,57.12 13.05,56.34 13.1,56.29 13.1,52.13 LEFT_MID2.B14
N$6
  Bottom 0.254: LEFT_MID2.A14 14,43.96 13.05,43.02 13.05,38.84 14,37.89 14,34.07 14.95,33.12 14.95,32.34 14,31.39 LEFT_LP.B14
N$7
  Bottom 0.254: RIGHT_HP.A14 14,76.57 14.95,75.62 14.95,74.84 14.05,73.94 14.05,70.02 14.95,69.12 14.95,68.34 14,67.39 RIGHT_MID1.B14
N$8
  Bottom 0.254: RIGHT_MID1.A14 14,52.57 14.95,51.62 14.95,50.84 14.05,49.94 14.05,46.02 14.95,45.12 14.95,44.34 14,43.39 RIGHT_MID2.B14
N$9
  Bottom 0.254: RIGHT_MID2.A14 14,31.96 13.05,31.02 13.05,26.84 14,25.89 14,22.07 14.95,21.12 14.95,20.34 14,19.39 RIGHT_LP.B14
N$31  (via drill 0.35)
  Top 0.254: R56.1 49.45,94.7 48.05,96.1 AD_LEFT_HP.8 v38.24,96.1 | AD_RIGHT_HP.8 v38.24,84 | AD_LEFT_MID1.8 v38.24,72 | AD_RIGHT_MID1.8 v38.24,60 | AD_LEFT_MID2.8 v38.24,48 | AD_RIGHT_MID2.8 v38.24,36 | AD_LEFT_LP.8 v38.24,24 | AD_RIGHT_LP.8 v38.2,12
  Bottom 0.254: v38.2,12 38.2,23.96 v38.24,24 v38.24,36 v38.24,48 v38.24,60 v38.24,72 v38.24,84 v38.24,96.1
N$32
  Top 0.254: R7.1 46.7,98.9 44.4,96.6 AD_LEFT_HP.9
N$33  (via drill 0.35)
  Top 0.254: R62.1 49.2,96.8 48.41,97.58 v46.41,97.58 | v44.2,97.5 43.8,97.1 AD_LEFT_HP.10 40.3,97.2 v40.3,98.3 | AD_RIGHT_HP.10 v40.2,86.2 | v40.2,14.2 AD_RIGHT_LP.10 | AD_LEFT_LP.10 v40.2,26.2 | AD_RIGHT_MID2.10 v40.2,38.3 | AD_LEFT_MID2.10 v40.3,50.3 | AD_RIGHT_MID1.10 v40.2,62.2 | AD_LEFT_MID1.10 v40.2,74.2
  Bottom 0.254: v44.2,97.5 44.28,97.58 v46.41,97.58 | v40.3,98.3 38.9,96.9 38.9,87.5 v40.2,86.2 38.9,84.9 38.9,75.5 v40.2,74.2 38.9,72.9 38.9,63.5 v40.2,62.2 39,61 39,51.6 v40.3,50.3 38.9,48.9 38.9,39.6 v40.2,38.3 38.9,37 38.9,27.5 v40.2,26.2 38.9,24.9 38.9,15.5 v40.2,14.2
N$34
  Top 0.254: AD_LEFT_HP.2 32.33,96.6 30.7,98.23 24,98.23 LEFT_HP.B7
N$35
  Top 0.254: LEFT_HP.B8 22.05,99.18 22.05,96.54 22.49,96.1 AD_LEFT_HP.3
N$36
  Top 0.254: LEFT_HP.B9 21,96.23 22.05,95.18 22.05,94.34 22.61,93.78 31.49,93.78 33.31,95.6 AD_LEFT_HP.4
N$37
  Top 0.254: LEFT_HP.B10 20.05,99.18 20.05,94.14 21.05,93.14 21.05,91.74 21.31,91.48 29.89,91.48 33.51,95.1 AD_LEFT_HP.5
N$39
  Top 0.254: AD_LEFT_MID1.9 R4.1
N$41
  Top 0.254: AD_LEFT_MID1.2 32.7,72.5 30.92,74.28 24.05,74.28 LEFT_MID1.B7
N$42
  Top 0.254: LEFT_MID1.B8 22.05,75.18 22.05,72.34 22.39,72 AD_LEFT_MID1.3
N$43
  Top 0.254: LEFT_MID1.B9 21.05,73.18 21.05,72.27 22.05,71.26 22.05,70.24 22.51,69.78 32.19,69.78 33.91,71.5 AD_LEFT_MID1.4
N$46
  Top 0.254: R5.1 53.85,48.5 AD_LEFT_MID2.9
N$48
  Top 0.254: AD_LEFT_MID2.2 33.1,48.5 31.4,50.2 23.97,50.2 LEFT_MID2.B7
N$49
  Top 0.254: LEFT_MID2.B8 22.05,51.18 22.05,48.64 22.69,48 AD_LEFT_MID2.3
N$50
  Top 0.254: AD_LEFT_MID2.4 33.21,47.5 31.49,45.78 22.61,45.78 22.05,46.34 22.05,47.18 21,48.23 LEFT_MID2.B9
N$51
  Top 0.254: AD_LEFT_MID2.5 34.8,47 31.4,43.6 21.79,43.6 21.05,44.34 21.05,45.14 20.05,46.14 20.05,51.18 LEFT_MID2.B10
N$53
  Top 0.254: R6.1 54.05,24.5 AD_LEFT_LP.9
N$55
  Top 0.254: AD_LEFT_LP.2 33.1,24.5 31.32,26.28 24.05,26.28 LEFT_LP.B7
N$59
  Top 0.254: LEFT_LP.B8 22.05,27.18 22.05,24.54 22.59,24 AD_LEFT_LP.3
N$60
  Top 0.254: LEFT_LP.B9 21,24.21 22.05,23.16 22.05,22.34 22.71,21.68 31.09,21.68 32.91,23.5 AD_LEFT_LP.4
N$61
  Top 0.254: AD_LEFT_LP.5 34.5,23 31.2,19.7 21.69,19.7 21.05,20.34 21.05,21.14 20.05,22.14 20.05,27.18 LEFT_LP.B10
N$63
  Top 0.254: AD_RIGHT_HP.9 54.05,84.5 R8.1
N$65
  Top 0.254: AD_RIGHT_HP.2 33.03,84.5 31.3,86.23 24,86.23 RIGHT_HP.B7
N$68
  Top 0.254: RIGHT_HP.B8 22.05,87.18 22.05,84.34 22.39,84 AD_RIGHT_HP.3
N$69
  Top 0.254: RIGHT_HP.B9 21,84.33 22.05,83.28 22.05,82.34 22.61,81.78 32.09,81.78 33.81,83.5 AD_RIGHT_HP.4
N$70
  Top 0.254: RIGHT_HP.B10 20.05,87.18 20.05,82.34 21.05,81.34 21.05,80.34 21.61,79.78 30.99,79.78 34.21,83 AD_RIGHT_HP.5
N$75
  Top 0.254: AD_RIGHT_MID1.2 33,60.5 31.2,62.3 28.41,62.3 28.39,62.28 24.05,62.28 RIGHT_MID1.B7
N$76
  Top 0.254: RIGHT_MID1.B8 22.05,63.18 22.05,60.84 22.89,60 AD_RIGHT_MID1.3
N$77
  Top 0.254: RIGHT_MID1.B9 21,60.33 22.05,59.28 22.05,58.34 22.61,57.78 31.89,57.78 33.61,59.5 AD_RIGHT_MID1.4
N$78
  Top 0.254: AD_RIGHT_MID1.5 35.1,59 31.7,55.6 21.79,55.6 21.05,56.34 21.05,57.34 20.05,58.34 20.05,63.18 RIGHT_MID1.B10
N$80
  Top 0.254: R2.1 53.95,36.5 AD_RIGHT_MID2.9
N$82
  Top 0.254: AD_RIGHT_MID2.2 32.8,36.5 31,38.3 28.41,38.3 28.39,38.28 24.05,38.28 RIGHT_MID2.B7
N$83
  Top 0.254: RIGHT_MID2.B8 22.05,39.18 22.05,36.84 22.89,36 AD_RIGHT_MID2.3
N$84
  Top 0.254: AD_RIGHT_MID2.4 33.21,35.5 31.49,33.78 22.41,33.78 22.05,34.14 22.05,35.28 21,36.33 RIGHT_MID2.B9
N$85
  Top 0.254: RIGHT_MID2.B10 20.05,39.18 20.05,34.14 21.05,33.14 21.05,32.34 21.61,31.78 31.19,31.78 34.41,35 AD_RIGHT_MID2.5
N$87
  Top 0.254: AD_RIGHT_LP.9 R3.1
N$89
  Top 0.254: AD_RIGHT_LP.2 32.8,12.5 31.02,14.28 24.05,14.28 RIGHT_LP.B7
N$90
  Top 0.254: RIGHT_LP.B8 22.05,15.18 22.05,12.84 22.89,12 AD_RIGHT_LP.3
N$91
  Top 0.254: AD_RIGHT_LP.4 32.81,11.5 31.09,9.78 22.61,9.78 22.05,10.34 22.05,11.05 21,12.1 RIGHT_LP.B9
N$92
  Top 0.254: AD_RIGHT_LP.5 34.7,11 31.3,7.6 21.49,7.6 21.05,8.04 21.05,9.14 20.05,10.14 20.05,15.18 RIGHT_LP.B10
NRST  (via drill 0.35)
  Top 0.254: v76.5,115.3 77.69,115.3 78.99,114 PRG-CONN.2 | v64.75,111.1 62.42,111.1 IC6.4
  Bottom 0.254: v76.5,115.3 68.47,115.3 64.74,111.57 64.74,111.14 64.72,111.12 v64.75,111.1
R-IN  (via drill 0.35)
  Top 0.254: v23.2,105.9 24.04,106.74 J2.1
  Bottom 0.254: RIGHT_HP.B14 14.95,88.18 14.95,93.44 14.05,94.34 14.05,97.62 15.05,98.62 15.05,99.62 15.2,99.77 15.2,102.7 18.4,105.9 v23.2,105.9
R-OUT  (via drill 0.35)
  Top 0.254: v26,114.7 26,112.76 J2.2
  Bottom 0.254: RIGHT_LP.A14 14,7.3 6.5,7.3 3.8,10 3.8,107.3 12.3,115.8 24.9,115.8 v26,114.7
SPI1_MOSI  (via drill 0.35)
  Top 0.254: IC6.13 67.03,106.45 67.03,108.23 v66.86,108.4 | v67.2,94.7 R56.2
  Bottom 0.254: v67.2,94.7 67.2,108.06 v66.86,108.4
SPI1_SCK
  Top 0.254: R62.2 64.8,96.8 65.45,97.45 IC6.11
SWCLK  (via drill 0.35)
  Top 0.254: PRG-CONN.1 77.97,107.43 v77.8,107.6 | v72.4,113.5 IC6.24
  Bottom 0.254: v72.4,113.5 72.9,113.5 77.8,108.6 v77.8,107.6
SWDIO  (via drill 0.35)
  Top 0.254: IC6.23 72.19,112.71 72.3,112.6 v72.3,112.5 | PRG-CONN.3 80.26,107.01 76.77,110.5 v74.1,110.5
  Bottom 0.254: v72.3,112.5 74,110.8 74,110.4 v74.1,110.5
V+  (via drill 0.35)
  Top 0.254: U1.1 35.62,104.63 C1.1
  Top 0.406: v11.1,110.4 12.51,108.99 J1.1 12.51,105.09 13,104.6 35.59,104.6 35.62,104.63
  Bottom 0.406: v11.1,110.4 9,110.4 5.1,106.5 5.1,92.7 | 5.1,92.7 9.97,92.7 LEFT_HP.A18 | RIGHT_HP.A18 5.13,80.73 5.1,80.7 | LEFT_MID1.A18 5.13,68.73 5.1,68.7 | RIGHT_MID1.A18 5.13,56.73 5.1,56.7 | LEFT_MID2.A18 5.13,44.73 5.1,44.7 | RIGHT_MID2.A18 5.13,32.73 5.1,32.7 | RIGHT_LP.A18 9,9.73 5.13,9.73 5.13,20.73 | 5.1,32.7 5.1,44.7 | 5.1,44.7 5.1,56.7 | 5.1,68.7 5.1,56.7 | 5.1,80.7 5.1,68.7 | 5.1,92.7 5.1,80.7 | LEFT_LP.A18 5.13,20.73 | 5.13,20.73 5.1,20.7 5.1,32.7
V-
  Top 0.406: LEFT_HP.B17 10.37,97.23 9.2,98.4 5.1,98.4 | RIGHT_HP.B17 10.37,85.23 9.2,86.4 5.2,86.4 5.1,86.5 | LEFT_MID1.B17 10.37,73.23 9.2,74.4 5.1,74.4 | RIGHT_MID1.B17 10.37,61.23 9.2,62.4 5.1,62.4 | LEFT_MID2.B17 10.37,49.23 9.2,50.4 5.1,50.4 | RIGHT_MID2.B17 10.37,37.23 9,38.6 5.1,38.6 | LEFT_LP.B17 10.37,25.23 8.8,26.8 5.1,26.8 | RIGHT_LP.B17 10.37,13.23 8.9,14.7 5.1,14.7 5.1,26.8 | J1.2 11.31,112.61 5.1,106.4 5.1,98.4 | 5.1,86.5 5.1,98.4 | 5.1,74.4 5.1,86.5 | 5.1,62.4 5.1,74.4 | 5.1,50.4 5.1,62.4 | 5.1,38.6 5.1,50.4 | 5.1,26.8 5.1,38.6